# EAGLE design Sensor Garis - Kecil (EAGLE 7.6.0)
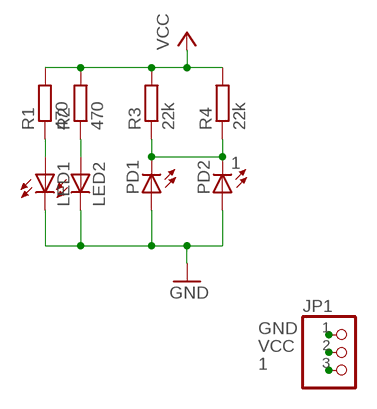
[diagram p0: schematic, sheet 1]

## Parts
JP1  PINHD-1X3  [1X03]
LED1  LED3MM  [LED3MM]
LED2  LED3MM  [LED3MM]
PD1  LED3MM  [LED3MM]
PD2  LED3MM  [LED3MM]
R1  470  R-EU_M0805  [M0805]
R2  470  R-EU_M0805  [M0805]
R3  22k  R-EU_M0805  [M0805]
R4  22k  R-EU_M0805  [M0805]

## Nets
1: JP1.3 PD1.K(C) PD2.K(C) R3.1 R4.1
GND: JP1.1 LED1.K(C) LED2.K(C) PD1.A PD2.A
N$1: LED2.A R2.1
N$2: LED1.A R1.1
VCC: JP1.2 R1.2 R2.2 R3.2 R4.2

## Library data of the parts
JP1 = pinhead:PINHD-1X3: PIN HEADER
LED1 LED2 PD1 PD2 = led:LED: LED OSRAM: - CHIPLED LG R971, LG N971, LY N971, LG Q971, LY Q971, LO R971, LY R971 LH N974, LH R974 LS Q976, LO Q976, LY Q976 LO Q996 - Hyper CHIPLED LW Q18S LB Q993, LB Q99A, LB R99A - SideLED LS A670, LO A670, LY A670, LG A670, LP A670 LB A673, LV A673, LT A673, LW A673 LH A674 LY A675 LS A676, LA A676, LO A676, LY A676, LW A676 LS A679, LY A679, LG A679 - Hyper Micro SIDELED® LS Y876, LA Y876, LO Y876, LY Y876 LT Y87S - SmartLED LW L88C, LW L88S LB L89C, LB L89S, LG L890 LS L89K, LO L89K, LY L89K LS L896, LA L896, LO L896, LY L896 - TOPLED LS T670, LO T670, LY T670, LG T670, LP T670 LSG T670, LSP T670, LSY T670, LOP T670, LYG T670 LG T671, LOG T671, LSG T671 LB T673, LV T673, LT T673, LW T673 LH T674 LS T676, LA T676, LO T676, LY T676, LB T676, LH T676, LSB T676, LW T676 LB T67C, LV T67C, LT T67C, LS T67K, LO T67K, LY T67K, LW E67C LS E67B, LA E67B, LO E67B, LY E67B, LB E67C, LV E67C, LT E67C LW T67C LS T679, LY T679, LG T679 LS T770, LO T770, LY T770, LG T770, LP T770 LB T773, LV T773, LT T773, LW T773 LH T774 LS E675, LA E675, LY E675, LS T675 LS T776, LA T776, LO T776, LY T776, LB T776 LHGB T686 LT T68C, LB T68C - Hyper Mini TOPLED® LB M676 - Mini TOPLED Santana® LG M470 LS M47K, LO M47K, LY M47K Source: http://www.osram.convergy.de LUXEON: - LUMILED® LXK2-PW12-R00, LXK2-PW12-S00, LXK2-PW14-U00, LXK2-PW14-V00 LXK2-PM12-R00, LXK2-PM12-S00, LXK2-PM14-U00 LXK2-PE12-Q00, LXK2-PE12-R00, LXK2-PE12-S00, LXK2-PE14-T00, LXK2-PE14-U00 LXK2-PB12-K00, LXK2-PB12-L00, LXK2-PB12-M00, LXK2-PB14-N00, LXK2-PB14-P00, LXK2-PB14-Q00 LXK2-PR12-L00, LXK2-PR12-M00, LXK2-PR14-Q00, LXK2-PR14-R00 LXK2-PD12-Q00, LXK2-PD12-R00, LXK2-PD12-S00 LXK2-PH12-R00, LXK2-PH12-S00 LXK2-PL12-P00, LXK2-PL12-Q00, LXK2-PL12-R00 Source: www.luxeon.com KINGBRIGHT: KA-3528ASYC Source: www.kingbright.com
R1-R4 = rcl:R-EU_: RESISTOR, European symbol

## Board
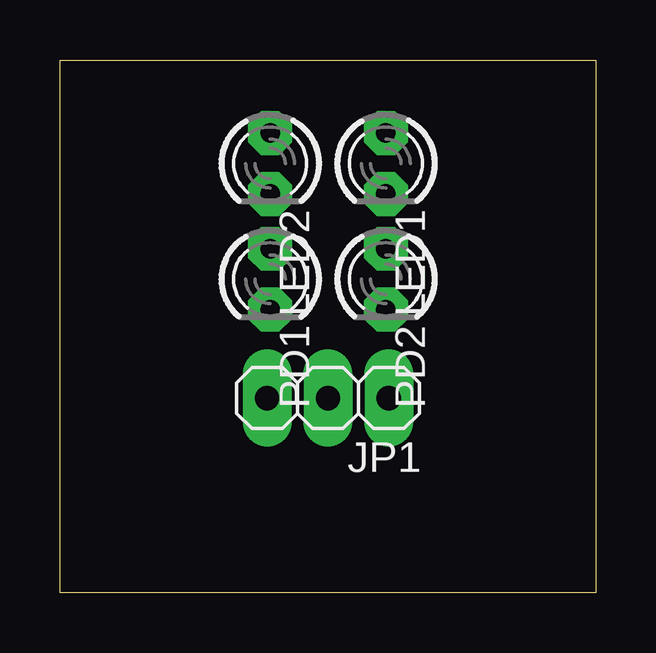
[diagram p1: board, top side]
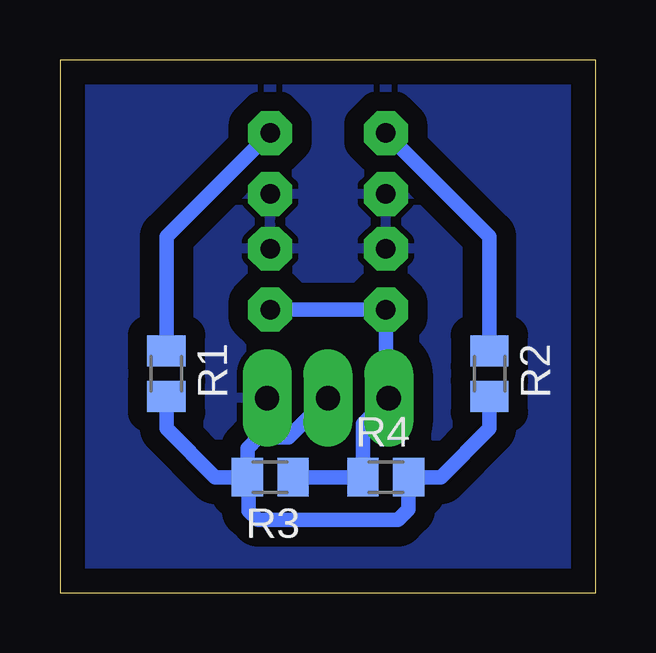
[diagram p2: board, bottom side, seen from below]

Size 22.35 x 22.23 mm. Coordinates in mm from the lower left corner, seen from the top.
Outline: 0,22.23 22.35,22.23 22.35,0 0,0 0,22.23
Copper layers (1*16): Top 0.035mm / dielectric 1.5mm / Bottom 0.035mm
Design rules "default *": minimum track width 10mil, minimum drill 24mil, track to track 8mil, track to pad 8mil, pad to pad 8mil, via to via 8mil, smd to smd 8mil, copper to edge 40mil, drill to drill 8mil, minimum pad ring 20mil, minimum via ring 8mil, stop-mask expansion 4mil, vias tented up to drill 0mil, thermal gap 10mil

### Footprints (pad centres in the part's own frame; a part is rotated, then mirrored left to right if it is on the bottom)
1X03 = drill 1.016 long: 1 -2.54,0; 2 0,0; 3 2.54,0
LED3MM = drill 0.813 octagon: A -1.27,0; K 1.27,0
M0805 = smd 1.3 x 1.6: 1 -0.95,0; 2 0.95,0

### Placement (x,y rotation side)
JP1  11.18,8.13 180 top
LED1  13.59,17.91 270 top
LED2  8.76,17.91 270 top
PD1  8.76,13.08 270 top
PD2  13.59,13.08 270 top
R1  17.91,9.14 270 bottom
R2  4.45,9.14 270 bottom
R3  13.59,4.83 180 bottom
R4  8.76,4.83 0 bottom

### Tracks (layer width: path | path; a pad name or v marks a point on that pad's centre or on a via)
1
  Bottom 0.61: R3.1 R4.1 9.71,7.05 JP1.3 8.76,8.26 PD1.K PD2.K
GND
  pour Bottom (isolate 0.813): 1.02,21.21 21.34,21.21 21.34,1.02 1.02,1.02
N$1
  Bottom 0.61: LED2.A 4.45,14.86 R2.1
N$2
  Bottom 0.61: LED1.A 17.91,14.86 R1.1
VCC
  Bottom 0.61: JP1.2 12.83,6.48 14.1,6.48 14.54,6.04 R3.2 | R2.2 4.45,6.86 6.48,4.83 R4.2 7.81,3.49 8.26,3.05 14.1,3.05 14.48,3.43 14.48,4.76 R3.2 | R1.2 17.91,6.86 15.88,4.83 R3.2